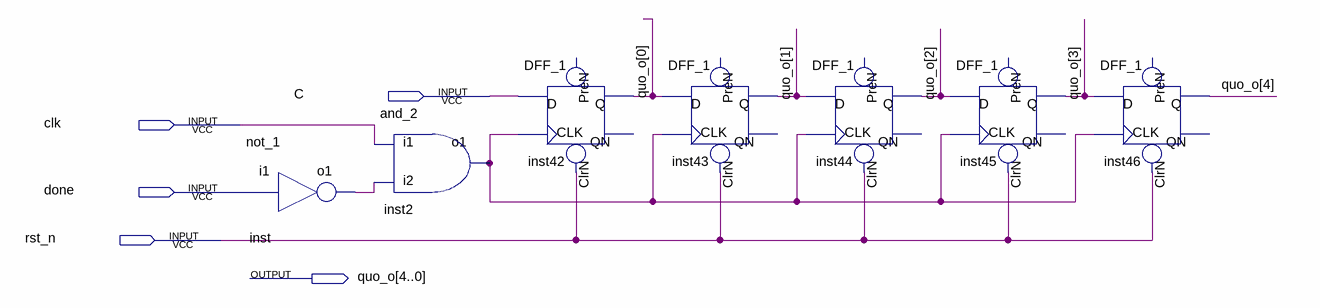
[diagram p0: schematic sheet]
// Quartus schematic quo_register.bdf as structural Verilog: 7 symbols, 5 pins
module quo_register (
  input  C,
  input  clk,
  input  done,
  input  rst_n,
  output [4:0] quo_o
);

  wire inst2_o1, inst_o1;

  not_1 inst (.i1(done), .o1(inst_o1));
  and_2 inst2 (.i1(clk), .i2(inst_o1), .o1(inst2_o1));
  DFF_1 inst42 (.CLK(inst2_o1), .D(C), .ClrN(rst_n), .Q(quo_o[0]));  // open: PreN, QN
  DFF_1 inst43 (.CLK(inst2_o1), .D(quo_o[0]), .ClrN(rst_n), .Q(quo_o[1]));  // open: PreN, QN
  DFF_1 inst44 (.CLK(inst2_o1), .D(quo_o[1]), .ClrN(rst_n), .Q(quo_o[2]));  // open: PreN, QN
  DFF_1 inst45 (.CLK(inst2_o1), .D(quo_o[2]), .ClrN(rst_n), .Q(quo_o[3]));  // open: PreN, QN
  DFF_1 inst46 (.CLK(inst2_o1), .D(quo_o[3]), .ClrN(rst_n), .Q(quo_o[4]));  // open: PreN, QN
endmodule
